# EAGLE schematic Circuit Set 1 (EAGLE 6.5.0)
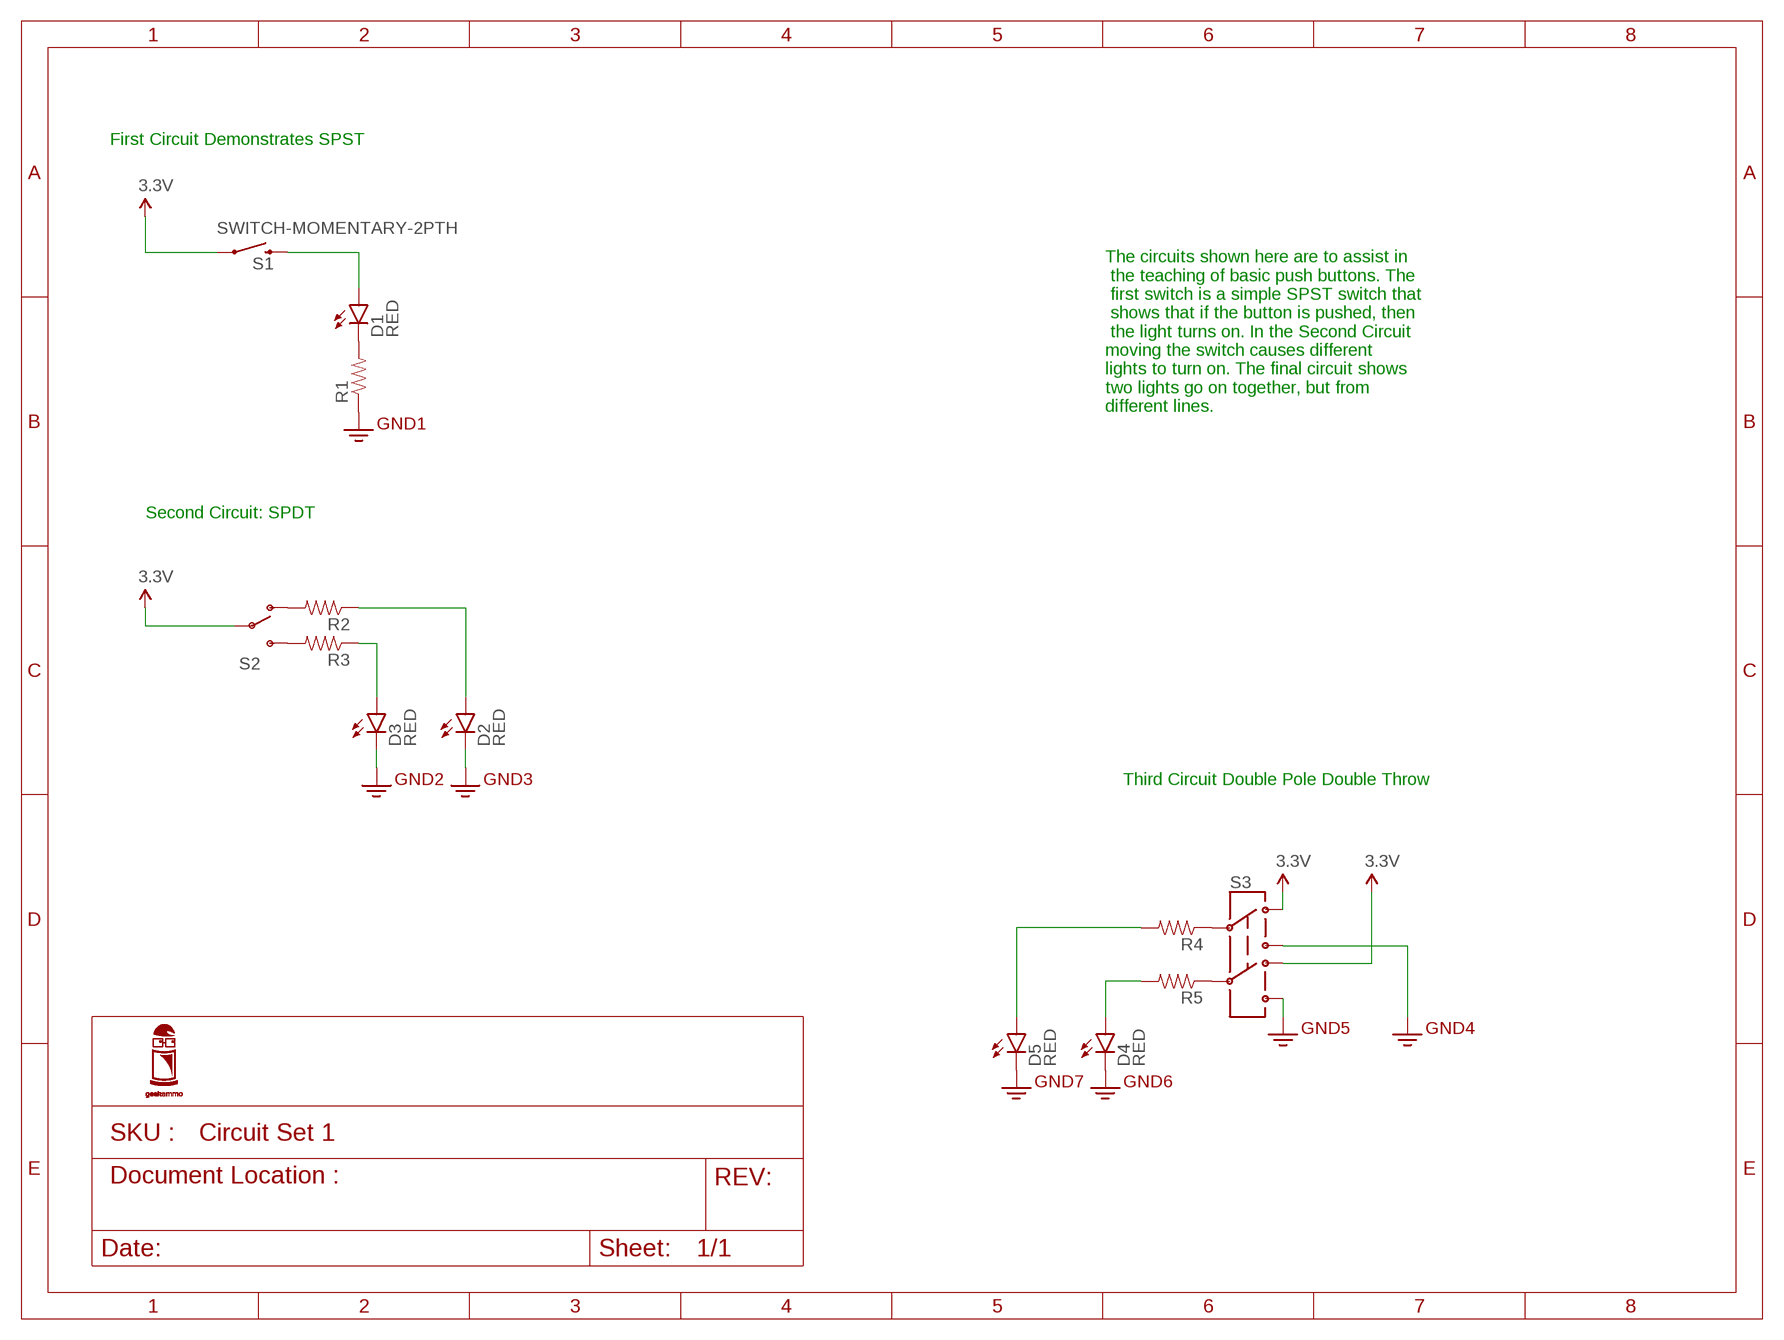
[diagram p0: schematic, sheet 1]

## Parts
D1  RED  LED-RED0603  [LED-0603]
D2  RED  LED-RED0603  [LED-0603]
D3  RED  LED-RED0603  [LED-0603]
D4  RED  LED-RED0603  [LED-0603]
D5  RED  LED-RED0603  [LED-0603]
R1  RESISTOR0805-RES  [0805]
R2  RESISTOR0805-RES  [0805]
R3  RESISTOR0805-RES  [0805]
R4  RESISTOR0805-RES  [0805]
R5  RESISTOR0805-RES  [0805]
S1  SWITCH-MOMENTARY-2PTH  [TACTILE-PTH]
S2  SWITCH-SPDTKIT  [SWITCH-SPDT_KIT]
S3  SWITCH-DPDTES  [ES]

## Nets
3.3V: D2.C D3.C D4.C D5.C R1.1 S1.1 S2.2(P) S3.1 S3.3 S3.4 S3.6 ; supply symbol labelled GND2
N$1: D1.A S1.3
N$2: D1.C R1.2
N$3: R3.2 S2.3(S)
N$4: R2.2 S2.1(O)
N$5: D2.A R2.1
N$6: D3.A R3.1
N$7: R5.1 S3.5
N$8: R4.1 S3.2
N$9: D5.A R4.2
N$10: D4.A R5.2

## Notes on the sheet
- First Circuit Demonstrates SPST
- The circuits shown here are to assist in
   the teaching of basic push buttons. The
   first switch is a simple SPST switch that
   shows that if the button is pushed, then
   the light turns on. In the Second Circuit
  moving the switch causes different 
  lights to turn on. The final circuit shows
  two lights go on together, but from
  different lines.
- Second Circuit: SPDT
- Third Circuit Double Pole Double Throw

## Library data of the parts
D1-D5 = SparkFun-LED:LED-RED: Assorted Red LEDs LilyPad 1206- DIO-09912 1206- DIO-00809 0603- DIO-00819 "SMART" means more efficient and expensive; PROD_ID: DIO-00819
R1-R5 = SparkFun-Passives:RESISTOR: Resistor Basic schematic elements and footprints for 0603, 1206, and PTH resistors.
S1 = SparkFun-Electromechanical:SWITCH-MOMENTARY-2: Various NO switches- pushbuttons, reed, etc; PROD_ID: SWCH-08441
S2 = SparkFun-Electromechanical:SWITCH-SPDT: SPDT Switch Simple slide switch, Spark Fun Electronics SKU : COM-00102 DPDT SMT slide switch, AYZ0202, SWCH-08179; PROD_ID: SWCH-08261
S3 = SparkFun-Electromechanical:SWITCH-DPDT: DPDT Version of the COM-00597